# EAGLE design tif (EAGLE 6.5.0)
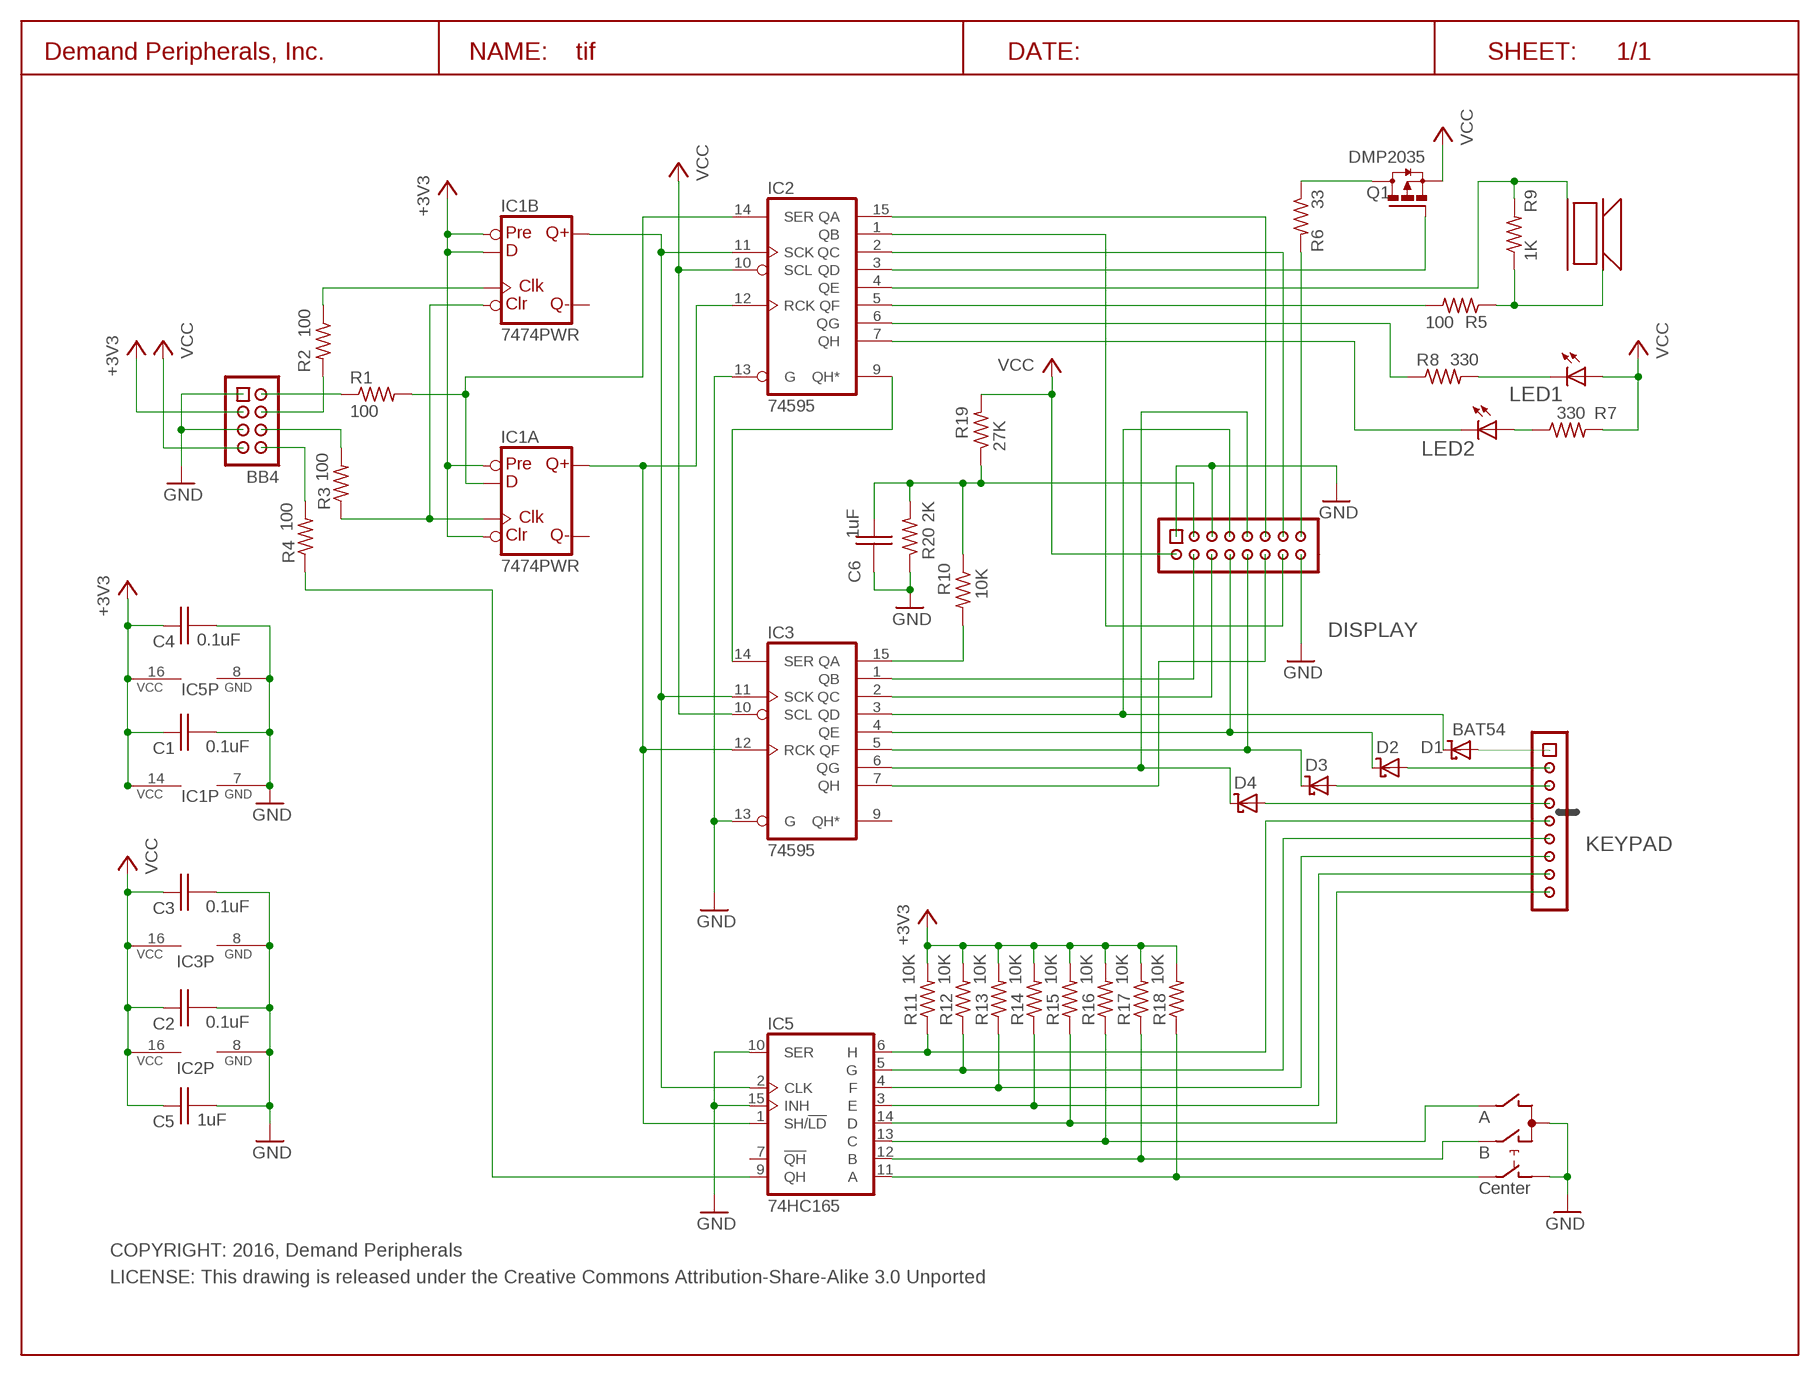
[diagram p0: schematic, sheet 1]

## Parts
2  ROTARY_ENCODER_W_SWITCHCTS_V_290  [CTS_290_VERT]
BB4  Hdr_4x2  HDR-4X2-SHR  [HDR-4X2]
C1  0.1uF  C0.1UF_C0603  [C0603]
C2  0.1uF  C0.1UF_C0603  [C0603]
C3  0.1uF  C0.1UF_C0603  [C0603]
C4  0.1uF  C0.1UF_C0603  [C0603]
C5  1uF  C0.1UF_C0603  [C0603]
C6  1uF  C1.0UF_C0603  [C0603]
D1  BAT54  [SOT23]
D2  BAT54  [SOT23]
D3  BAT54  [SOT23]
D4  BAT54  [SOT23]
DISPLAY  HDR-8X2  [HDR-8X2]
IC1  7474PWR  74AHC74SS  [SO14]
IC2  74595  [SO16]
IC3  74595  [SO16]
IC5  74HC165  [SO16]
KEYPAD  HDR-9X1  [HDR-9X1]
LED1  LED-0805-GRN  [0805]
LED2  LED-0805-RED  [0805]
Q1  DMP2035  [SOT23]
R1  100  R100_R0603  [R0603]
R2  100  R100_R0603  [R0603]
R3  100  R100_R0603  [R0603]
R4  100  R100_R0603  [R0603]
R5  100  R100_R0603  [R0603]
R6  33  R33R0603  [R0603]
R7  330  R330_R0603  [R0603]
R8  330  R330_R0603  [R0603]
R9  1K  R1K_R0603  [R0603]
R10  10K  R10K_R0603  [R0603]
R11  10K  R10K_R0603  [R0603]
R12  10K  R10K_R0603  [R0603]
R13  10K  R10K_R0603  [R0603]
R14  10K  R10K_R0603  [R0603]
R15  10K  R10K_R0603  [R0603]
R16  10K  R10K_R0603  [R0603]
R17  10K  R10K_R0603  [R0603]
R18  10K  R10K_R0603  [R0603]
R19  27K  R27K_R0603  [R0603]
R20  2K  R2K_R0603  [R0603]
SPK1  PKM13EPY  [PKM13EPY]
U$5  DP_FRAME_L  [LETTER_L]

## Nets
+3V3: BB4.3 C1.1 C4.1 IC1.1(A:CLR) IC1.4(A:PRE) IC1.10(B:PRE) IC1.12(B:D) IC1.14(P:VCC) IC5.16(VCC) R11.2 R12.2 R13.2 R14.2 R15.2 R16.2 R17.2 R18.2
GND: 2.C 2.D BB4.1 BB4.5 C1.2 C2.2 C3.2 C4.2 C5.2 C6.2 DISPLAY.1 DISPLAY.5 DISPLAY.16 IC1.7(P:GND) IC2.8(GND) IC2.13(G) IC3.8(GND) IC3.13(G) IC5.8(GND) IC5.10(SER) IC5.15(INH) R20.1
N$1: BB4.2 R1.1
N$2: BB4.8 R4.2
N$3: IC5.9(QH) R4.1
N$4: BB4.6 R3.2
N$5: BB4.4 R2.2
N$6: IC1.2(A:D) IC2.14(SER) R1.2
N$7: IC2.9(QH*) IC3.14(SER)
N$8: C6.1 DISPLAY.3 R10.1 R19.1 R20.2
N$9: 2.E IC5.11(A) R18.1
N$10: D3.3(CC) DISPLAY.10 IC3.5(QF)
N$11: IC3.15(QA) R10.2
N$12: IC1.9(B:Q) IC2.11(SCK) IC3.11(SCK) IC5.2(CLK)
N$15: IC1.3(A:CLK) IC1.13(B:CLR) R3.1
N$17: IC2.7(QH) LED2.C
N$18: IC1.11(B:CLK) R2.1
N$19: IC2.3(QD) Q1.1(G)
N$20: D1.1(A) KEYPAD.1
N$21: D2.1(A) KEYPAD.2
N$22: D3.1(A) KEYPAD.3
N$23: D4.1(A) KEYPAD.4
N$24: D1.3(CC) DISPLAY.7 IC3.3(QD)
N$25: IC2.6(QG) R8.1
N$26: IC2.5(QF) R5.2
N$27: IC2.4(QE) R9.2 SPK1.1(GND1)
N$28: R5.1 R9.1 SPK1.2(GND2)
N$29: Q1.3(D) R6.1
N$30: DISPLAY.11 IC2.15(QA)
N$32: DISPLAY.14 IC2.1(QB)
N$33: DISPLAY.13 IC2.2(QC)
N$34: LED1.C R8.2
N$35: IC1.5(A:Q) IC2.12(RCK) IC3.12(RCK) IC5.1(SH/!LD)
N$36: DISPLAY.4 IC3.1(QB)
N$37: D4.3(CC) DISPLAY.9 IC3.6(QG)
N$38: IC5.6(H) KEYPAD.5 R11.1
N$39: DISPLAY.6 IC3.2(QC)
N$40: IC5.5(G) KEYPAD.6 R12.1
N$42: IC5.4(F) KEYPAD.7 R13.1
N$44: DISPLAY.15 R6.2
N$45: LED2.A R7.1
N$48: DISPLAY.12 IC3.7(QH)
N$50: D2.3(CC) DISPLAY.8 IC3.4(QE)
N$51: IC5.3(E) KEYPAD.8 R14.1
N$52: 2.B IC5.13(C) R16.1
N$53: 2.A IC5.12(B) R17.1
N$54: IC5.14(D) KEYPAD.9 R15.1
VCC: BB4.7 C2.1 C3.1 C5.1 DISPLAY.2 IC2.10(SCL) IC2.16(VCC) IC3.10(SCL) IC3.16(VCC) LED1.A Q1.2(S) R7.2 R19.2
Unconnected: 2.GND1(G) 2.GND2(G) IC1.6(A:!Q) IC1.8(B:!Q) IC3.9(QH*) IC5.7(!QH)

## Notes on the sheet
- A
- B
- Center
- COPYRIGHT: 2016, Demand Peripherals
- LICENSE: This drawing is released under the Creative Commons Attribution-Share-Alike 3.0 Unported

## Library data of the parts
2 = dpi-swsens:ROTARY_ENCODER_W_SWITCH; VENDOR: Digikey; VENDOR-PART-NUM: CT3006-ND
BB4 = dpi-conn:HDR-4X2-SHR: Shrouded 4x2 pin header; VENDOR: Digikey; VENDOR-PART-NUM: 609-3530-ND
C1-C5 = dpi-passive:C0.1UF_: 0.1 uF Capacitor, 25V, X7R; VENDOR: Digikey; VENDOR-PART-NUM: 1276-1126-2-ND
C6 = dpi-passive:C1.0UF_: 1.0 uF Capacitor, 25V, Y5V; VENDOR: Digikey; VENDOR-PART-NUM: 490-3897-2-ND
D1-D4 = dpi-diopto:BAT54: Schottky Diode; VENDOR: Digikey; VENDOR-PART-NUM: DB3Y313KELCT-ND
DISPLAY = dpi-conn:HDR-8X2: Header, 8x2, 0.1 inch; VENDOR: Digikey; VENDOR-PART-NUM: S2012EC-08-ND
IC1 = dpi-transic:74AHC74: Dual D type positive edge triggered FLIP FLOP, preset and clear; VENDOR: Digikey; VENDOR-PART-NUM: 568-4458-1-ND
IC2 IC3 = dpi-transic:74*595: 8-bit SHIFT REGISTER, output latch; VENDOR: Digikey; VENDOR-PART-NUM: 74HC595D(BJ)CT-ND
IC5 = dpi-transic:74HC165: NXP 74HC165 parallel-to-serial shift register; VENDOR: Digikey; VENDOR-PART-NUM: 568-1409-1-ND
KEYPAD = dpi-conn:HDR-9X1: Header, 9x1; VENDOR: Digikey; VENDOR-PART-NUM: S1012EC-09-ND
LED1 = dpi-diopto:LED-0805-GRN: Green 0805 LED, 26mcd@20ma, 160degree; VENDOR: Digikey; VENDOR-PART-NUM: 475-1410-1-ND
LED2 = dpi-diopto:LED-0805-RED: Red 0805 LED, 41mcd@20ma, 160degree; VENDOR: Digikey; VENDOR-PART-NUM: 475-1415-6-ND
Q1 = dpi-transic:DMP2035: PFET; VENDOR: Digikey; VENDOR-PART-NUM: DMP2035U-7DICT-ND
R1-R5 = dpi-passive:R100_: 100 Ohm resistor, 1%, 0.1 watt; VENDOR: Digikey; VENDOR-PART-NUM: 311-100HRTR-ND
R6 = dpi-passive:R33: 33 Ohm resistor, 1%, 0.1 watt; VENDOR: Digikey; VENDOR-PART-NUM: 311-33.0HRTR-ND
R7 R8 = dpi-passive:R330_: 330 Ohm resistor, 1%, 0.1 watt; VENDOR: Digikey; VENDOR-PART-NUM: 311-330HRTR-ND
R9 = dpi-passive:R1K_: 1K Resistor, 1%, 0.1 watt; VENDOR: Digikey; VENDOR-PART-NUM: 311-1.00KHRTR-ND
R10-R18 = dpi-passive:R10K_: 10K Resistor, 1%, 0.1 watt; VENDOR: Digikey; VENDOR-PART-NUM: 311-1.00KHRTR-ND
R19 = dpi-passive:R27K_: 27K Resistor, 1%, 0.1 watt; VENDOR: Digikey; VENDOR-PART-NUM: 311-27.0KHRTR-ND
R20 = dpi-passive:R2K_: 2K Resistor, 1%, 0.1 watt; VENDOR: Digikey; VENDOR-PART-NUM: 311-2.00KHRTR-ND
SPK1 = dpi-swsens:PKM13EPY: Murata PKM13EPY piezo speaker; VENDOR: Sparkfun; VENDOR-PART-NUM: 490-4698-ND
U$5 = DP:DP_FRAME_L: Landscape/Letter Document Frame

## Board
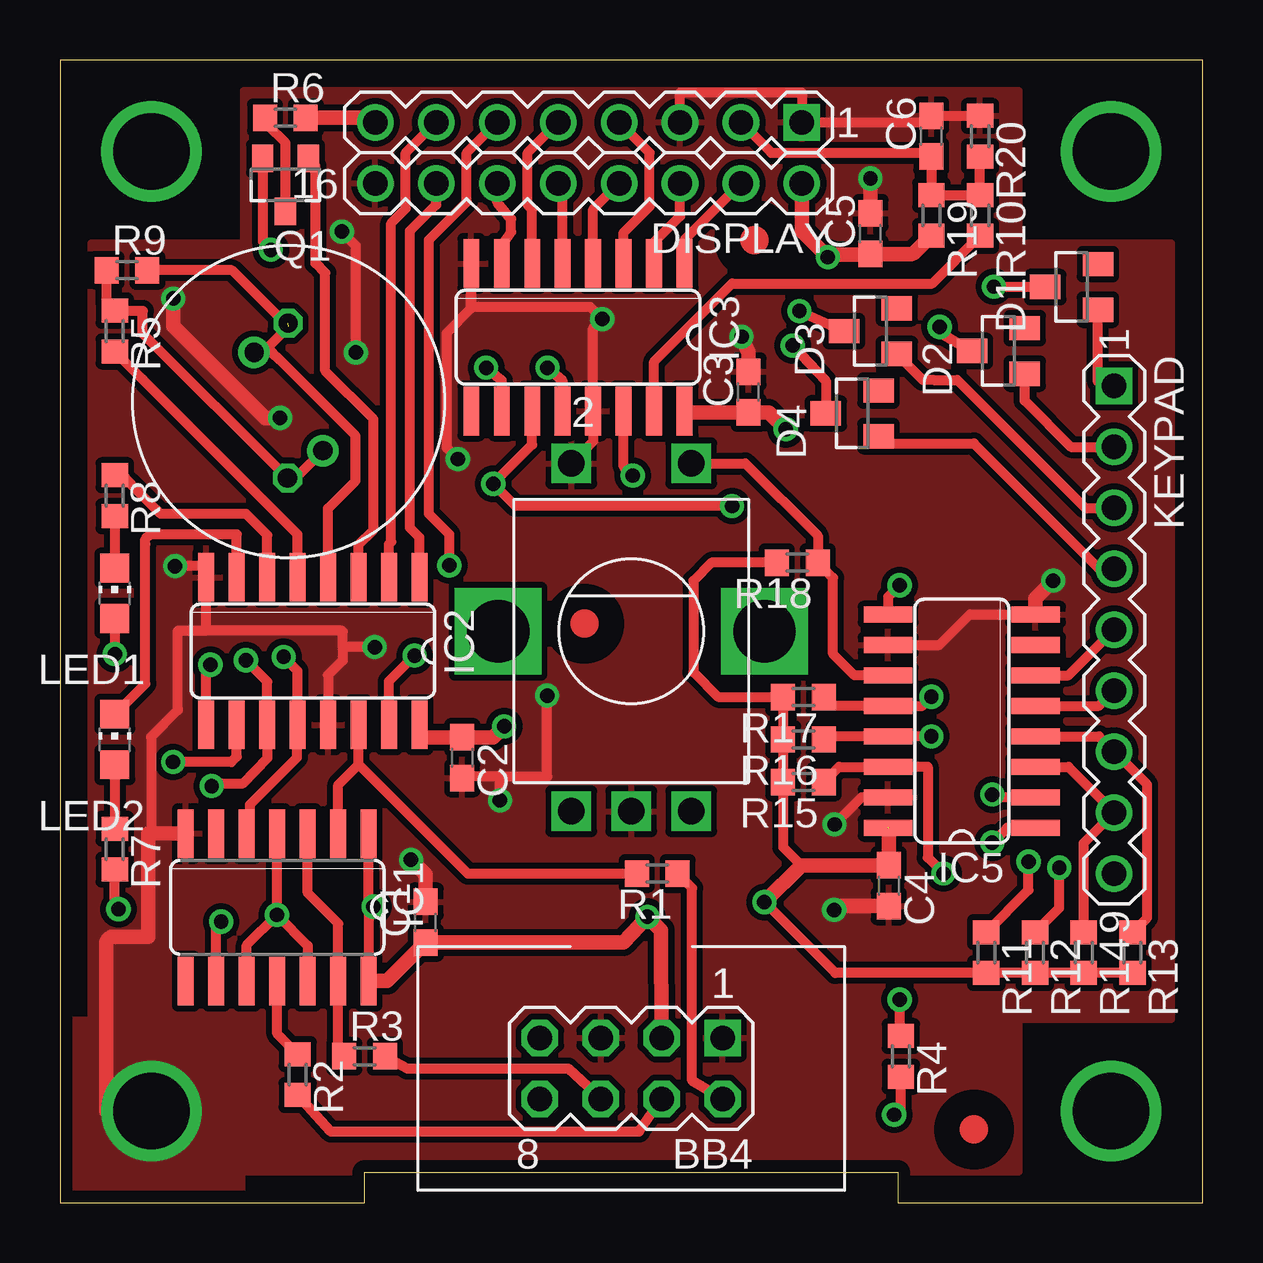
[diagram p1: board, top side]
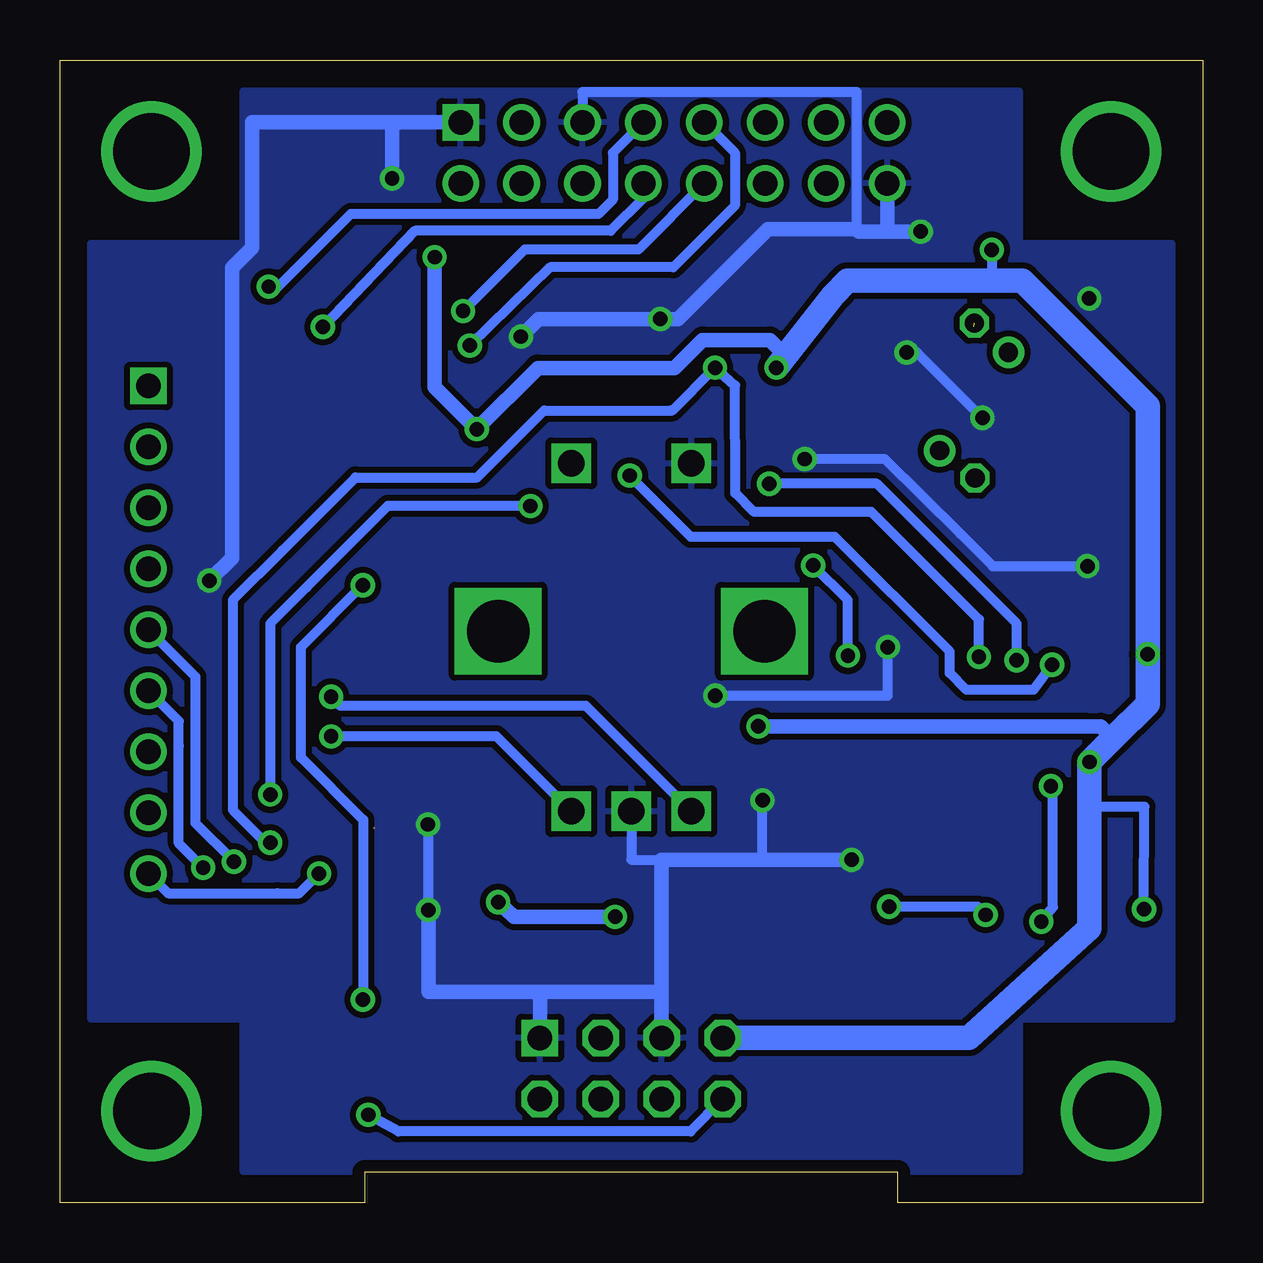
[diagram p2: board, bottom side, seen from below]

Size 47.62 x 47.62 mm. Coordinates in mm from the lower left corner, seen from the top.
Outline: 0,0 12.7,0 12.7,1.27 34.92,1.27 34.92,0 47.62,0 47.62,47.62 0,47.62 0,0
Copper layers (1*16): Top 0.035mm / dielectric 1.5mm / Bottom 0.035mm
Design rules "default *": minimum track width 10mil, minimum drill 20mil, track to track 10mil, track to pad 10mil, pad to pad 10mil, via to via 10mil, smd to smd 10mil, copper to edge 20mil, drill to drill 12mil, minimum pad ring 10mil, minimum via ring 8mil, stop-mask expansion 4mil, vias tented up to drill 0mil, thermal gap 10mil
tKeepout: area 15.1,1.3 to 32.5,9.9

### Footprints (pad centres in the part's own frame; a part is rotated, then mirrored left to right if it is on the bottom)
CTS_290_VERT = drill 1.1 square: A -2.5,-7.5; B 2.5,-7.5; C 0,-7.5; D -2.5,7; E 2.5,7 | drill 2.6 square: GND1 -5.55,0; GND2 5.55,0
HDR-4X2 = drill 1.016 square: 1 -3.81,-1.27 | drill 1.016 octagon: 2 -3.81,1.27; 3 -1.27,-1.27; 4 -1.27,1.27; 5 1.27,-1.27; 6 1.27,1.27; 7 3.81,-1.27; 8 3.81,1.27
C0603 = smd 1.1 x 1: 1 -0.85,0; 2 0.85,0
SOT23 = smd 1.016 x 1.27: 1 -0.95,-1.1; 2 0.95,-1.1; 3 0,1.1
HDR-8X2 = drill 1.016 square: 1 -8.89,-1.27 | drill 1.016: 2 -8.89,1.27; 3 -6.35,-1.27; 4 -6.35,1.27; 5 -3.81,-1.27; 6 -3.81,1.27; 7 -1.27,-1.27; 8 -1.27,1.27; 9 1.27,-1.27; 10 1.27,1.27; 11 3.81,-1.27; 12 3.81,1.27; 13 6.35,-1.27; 14 6.35,1.27; 15 8.89,-1.27; 16 8.89,1.27
SO14 = smd 0.66 x 2.032: 1 -3.81,-3.073; 2 -2.54,-3.073; 3 -1.27,-3.073; 4 0,-3.073; 5 1.27,-3.073; 6 2.54,-3.073; 7 3.81,-3.073; 8 3.81,3.073; 9 2.54,3.073; 10 1.27,3.073; 11 0,3.073; 12 -1.27,3.073; 13 -2.54,3.073; 14 -3.81,3.073
SO16 = smd 0.66 x 2.032: 1 -4.445,-3.073; 2 -3.175,-3.073; 3 -1.905,-3.073; 4 -0.635,-3.073; 5 0.635,-3.073; 6 1.905,-3.073; 7 3.175,-3.073; 8 4.445,-3.073; 9 4.445,3.073; 10 3.175,3.073; 11 1.905,3.073; 12 0.635,3.073; 13 -0.635,3.073; 14 -1.905,3.073; 15 -3.175,3.073; 16 -4.445,3.073
HDR-9X1 = drill 1.016 square: 1 0,-10.16 | drill 1.016: 2 0,-7.62; 3 0,-5.08; 4 0,-2.54; 5 0,0; 6 0,2.54; 7 0,5.08; 8 0,7.62; 9 0,10.16
0805 = smd 1.2 x 1.2: A -1.05,0; C 1.05,0
SOT23' = smd 0.889 x 1.143: 1 -0.95,-1.1; 2 0.95,-1.1; 3 0,1.1
R0603 = smd 1 x 1.1: 1 -0.85,0; 2 0.85,0
PKM13EPY = drill 0.8: 1 -2.5,0; 2 2.5,0

### Placement (x,y rotation side)
2  23.81,23.81 0 top
BB4  23.81,5.59 180 top
C1  15.24,11.68 90 top
C2  16.76,18.54 270 top
C3  28.7,33.78 90 top
C4  34.54,13.21 270 top
C5  33.78,40.39 90 top
C6  36.32,44.45 90 top
D1  42.16,38.16 90 top
D2  39.12,35.5 90 top
D3  33.78,36.32 90 top
D4  33.02,32.89 90 top
DISPLAY  22.03,43.75 180 top
IC1  9.06,12.31 180 top
IC2  10.54,22.99 180 top
IC3  21.59,36.07 180 top
IC5  37.59,20.07 90 top
KEYPAD  43.94,23.88 180 top
LED1  2.29,25.4 90 top
LED2  2.29,19.3 90 top
Q1  DMP2035  [SOT23']  9.4,42.42 180 top
R1  24.89,13.72 180 top
R2  9.91,5.33 270 top
R3  12.7,6.1 0 top
R4  35.05,6.1 270 top
R5  2.29,36.32 270 top
R6  9.4,45.21 0 top
R7  2.29,14.73 270 top
R8  2.29,29.46 270 top
R9  2.79,38.86 0 top
R10  38.35,41.15 270 top
R11  38.61,10.41 270 top
R12  40.64,10.41 270 top
R13  44.7,10.41 270 top
R14  42.67,10.41 270 top
R15  30.99,17.53 180 top
R16  30.99,19.3 180 top
R17  30.99,21.07 180 top
R18  30.73,26.67 180 top
R19  36.32,41.15 270 top
R20  38.35,44.45 270 top
SPK1  9.53,33.39 305 top
U$1  [DPI-2]  18.8,12.45 0 bottom
U$2  [FIDUCIAL]  38.1,3.05 0 top
U$3  [FIDUCIAL]  28.94,40.12 0 top
U$4  [FIDUCIAL]  21.86,24.13 0 top
U$5  -1.99,-2.22 90 top

### Tracks (layer width: path | path; a pad name or v marks a point on that pad's centre or on a via)
+3V3  (via drill 0.6)  (1 unrouted)
  Top 0.406: IC1.4 9.04,15.37 v9.04,11.99 | IC1.12 10.32,10.71 v9.04,11.99 | IC1.10 7.79,10.73 v9.04,11.99 | IC1.1 12.87,12.33 v13.07,12.33 12.87,12.13 IC1.14 | R13.2 R14.2 R12.2 R11.2 32.32,9.56 v29.36,12.52 | R18.2 27.16,26.67 26.4,25.91 26.4,22.11 27.43,21.08 30.12,21.08 R17.2 R16.2 R15.2 30.14,14.82 30.9,14.06
  Top 0.61: 34.54,15.62 C4.1 30.9,14.06 v29.36,12.52 | IC1.14 13.64,9.23 C1.1 23.48,10.83 v24.49,11.91 25.06,11.35 BB4.3
  Bottom 0.406: v13.07,12.33 9.38,12.33 v9.04,11.99
  Bottom 0.61: v29.36,12.52 28.69,11.91 v24.49,11.91
GND  (via drill 0.6, 3.17 pad 3.17)
  Top 0.406: R20.1 C6.2 36.04,45.02 DISPLAY.1 30.92,46.28 25.84,46.28 DISPLAY.5 | 2.D 22.23,31.73 IC3.13 22.23,36.45 v22.61,36.83 22.1,37.34 20.57,37.34 17.14,37.34 IC3.8 17.14,37.27 16.13,36.26 16.13,31.45 v16.59,30.99 | C2.2 16.7,17.75 18.34,17.75 | 6.1,23.84 IC2.8 6.1,26.53 v4.8,26.53 | v20.31,21.13 20.31,17.75 18.34,17.75 | 6.1,23.84 11.75,23.84 11.79,23.8 11.79,23.16 | IC2.13 11.18,21.98 11.79,22.59 11.79,23.16 | v12.33,35.43 12.33,39.89 v11.75,40.48 | v13.12,23.15 13.12,23.16 11.79,23.16 | v18.34,16.76 18.34,17.75 | IC1.7 3.91,15.38 | 3.91,15.38 3.58,15.38 | 6.1,23.84 4.93,23.84 4.92,23.82 4.92,20.59 4.92,20.52 3.8,19.41 3.8,15.49 3.91,15.38 | IC5.10 36.66,23.24 37.94,24.51 IC5.8 | IC5.15 33.41,16.89 v32.28,15.76
  Top 0.61: v33.78,42.69 C5.2 | C3.2 28.69,35.42 v28.41,36.09 | v3.81,3.81 1.93,3.81 1.93,10.78 arc-90 2.22,11.07 3.68,11.07 3.68,15.38 3.91,15.38 IC1.7 | C1.2 15.24,13.68 v14.63,14.29 | v4.72,37.68 4.72,36.54 8.2,33.06 8.55,32.71 v9.17,32.71 | IC5.8 40.66,25.18 v41.4,25.92 | C4.2 32.44,12.36 v32.27,12.19
  Bottom 0.406: DISPLAY.5 25.84,46.29 14.41,46.29 14.41,40.56 14.33,40.48 | v16.59,30.99 13.23,30.99 10.1,27.88 8.75,26.53 v4.8,26.53 | v13.12,23.15 13.12,21.13 v20.31,21.13 | v18.34,16.76 18.34,14.29 18.3,14.29 | v12.33,35.43 11.9,35.43 v9.17,32.71 | 2.C 23.81,14.29 22.54,14.29 | v32.28,15.76 32.28,12.21 v32.27,12.19
  Bottom 0.61: v33.78,42.69 33.78,44.7 arc90 33.47,45.02 | DISPLAY.1 33.47,45.02 | 33.47,45.02 39.62,45.02 39.62,39.8 40.45,38.98 40.45,27 40.45,26.87 v41.4,25.92 | 14.91,14.29 v14.63,14.29 18.3,14.29 22.54,14.29 22.54,8.78 | 22.54,8.78 BB4.5 | 27.62,8.78 BB4.1 | 22.54,8.78 27.62,8.78 | 14.33,40.48 13.14,40.48 | 13.14,40.48 DISPLAY.16 | 13.14,40.48 v11.75,40.48 | 14.41,40.56 18.12,40.56 21.87,36.82 22.59,36.82 v22.61,36.83 27.67,36.83 v28.41,36.09 | v32.27,12.19 32.27,8.78 27.62,8.78
  pour Bottom (isolate 0.254): 40.01,1.27 40.01,7.62 46.35,7.62 46.35,40.01 40.01,40.01 40.01,46.35 7.62,46.35 7.62,40.01 1.27,40.01 1.27,7.62 7.62,7.62 7.62,1.27
  pour Top (isolate 0.254): 40.01,1.27 40.01,7.62 46.35,7.62 46.35,40.01 40.01,40.01 40.01,46.35 7.62,46.35 7.62,40.01 1.27,40.01 1.27,7.62 0.51,7.62 0.51,0.51 7.62,0.51 7.62,1.27
MOUNT  (via drill 3.17 pad 3.17)
  other vias: 43.81,43.81
N$1
  Top 0.406: BB4.2 26.35,5.08 26.35,13.11 R1.1
N$2  (via drill 0.6)
  Top 0.406: R4.2 35.05,3.94 v34.77,3.66
  Bottom 0.406: v34.77,3.66 33.52,2.96 21.34,2.96 BB4.8
N$3  (via drill 0.6)
  Top 0.406: v35,25.73 34.52,25.25 IC5.9 | R4.1 35,6.95 v35,8.46
  Bottom 0.406: v35,25.73 37.58,23.15 37.58,18.54 34.99,15.95 34.99,8.47 v35,8.46
N$4
  Top 0.406: BB4.6 21.18,5.59 14.48,5.59 R3.2
N$5
  Top 0.406: BB4.4 24.14,2.96 11.29,2.96 R2.2
N$6
  Top 0.406: 12.45,18.26 IC2.14 | IC1.2 11.6,17.41 12.45,18.26 | 12.45,18.26 16.99,13.72 R1.2
N$7  (via drill 0.6)
  Top 0.406: v23.88,30.3 23.5,30.68 IC3.14 | IC2.9 6.1,22.05 v6.27,22.42
  Bottom 0.406: v6.27,22.42 7.05,21.37 9.84,21.37 10.54,22.07 10.54,22.96 15.33,27.75 21.32,27.75 v23.88,30.3
N$8
  Top 0.406: R20.2 R10.1 R19.1 C6.1 36.17,43.75 29.65,43.75 DISPLAY.3
N$9
  Top 0.406: R18.1 31.5,26.58 | IC5.11 33.12,21.97 32.22,22.87 32.22,26.03 R18.1 | 2.E 28.57,30.81 31.59,27.8 R18.1
N$10  (via drill 0.6)
  Top 0.406: v30.82,37.16 D3.3 | IC3.5 20.95,42.29 DISPLAY.10
  Bottom 0.406: DISPLAY.10 23.52,39.73 28.26,39.73 v30.82,37.16
N$11
  Top 0.406: IC3.15 24.77,35.05 28.02,38.3 36.36,38.3 R10.2
N$12  (via drill 0.6)
  Top 0.406: v6.72,11.71 6.51,11.54 IC1.9 | v6.33,17.36 6.62,17.48 7.63,17.48 8.65,18.53 IC2.11 8.64,21.72 v7.75,22.61 | IC3.11 19.68,31.59 v18.06,29.96 18.99,29.03 v28.02,29.03 | IC5.2 38.98,16.89 v38.86,17
  Bottom 0.406: v6.72,11.71 6.24,12.31 6.24,17.27 v6.33,17.36 | v18.06,29.96 13.58,29.96 7.75,24.13 v7.75,22.61 | v28.02,29.03 33.96,29.03 37.34,25.65 38.86,24.13 v38.86,17
N$15
  Top 0.406: R3.1 11.6,6.35 IC1.13 11.6,11.63 10.32,12.9 IC1.3
N$17
  Top 0.406: IC2.7 7.37,27.85 3.75,27.85 3.56,27.66 3.56,27.43 3.56,21.62 LED2.C
N$18
  Top 0.406: R2.1 9.05,7.04 IC1.11
N$19
  Top 0.406: Q1.1 10.65,43.21 10.65,41.74 10.65,39.15 11.06,38.75 11.06,34.66 13.07,32.65 13.07,28.04 12.45,27.42 IC2.3
N$20
  Top 0.406: KEYPAD.1 43.26,34.21 D1.1
N$21
  Top 0.406: KEYPAD.2 42.14,31.5 40.22,33.42 D2.1
N$22
  Top 0.406: KEYPAD.3 42.74,28.96 37.4,34.29 36.4,34.29 35.96,34.29 D3.1
N$23
  Top 0.406: KEYPAD.4 43.32,26.42 38.1,31.64 34.68,31.64 34.43,31.64 D4.1
N$24  (via drill 0.6)
  Top 0.406: DISPLAY.7 24.57,43.75 24.57,41.52 23.5,40.44 IC3.3 | D1.3 41.05,38.18 v38.92,38.18
  Bottom 0.406: DISPLAY.7 24.57,43.75 24.57,41.81 25.18,41.2 35.51,41.2 38.53,38.18 v38.92,38.18
N$25
  Top 0.406: IC2.6 8.64,27.81 7.75,28.7 4.2,28.7 2.95,29.95 2.59,30.31 R8.1
N$26
  Top 0.406: R5.2 3.4,34.35 | 3.4,34.35 3.46,34.3 | IC2.5 9.91,27.84 7.8,29.95 3.4,34.35
N$27  (via drill 0.8)  (1 unrouted)
  Top 0.406: R9.2 7.17,38.86 9.53,36.51 8.45,35.44 SPK1.1 8.85,35.44 9.17,35.12 12.32,31.97 12.32,30.07 11.18,28.93 IC2.4
  other vias: 9.51,36.65
N$28  (via drill 0.8)
  Top 0.406: R9.1 1.94,37.51 R5.1 | R5.1 2.62,37.17 | R5.1 3.46,37.17 3.46,36.22 v9.48,30.2 9.81,30.2 SPK1.2
N$29
  Top 0.406: Q1.3 9.4,44.17 8.69,44.88 8.69,45.07 R6.1
N$30  (via drill 0.6)
  Top 0.406: DISPLAY.11 16.95,43.75 16.95,41.71 15.38,40.13 15.38,36.8 15.38,28.7 16.23,27.85 v16.23,26.56 | IC2.15 13.72,21.73 v14.78,22.8
  Bottom 0.406: v14.78,22.8 14.78,25.11 v16.23,26.56
N$32
  Top 0.406: DISPLAY.14 15.68,41.74 15.68,41.59 14.59,40.5 14.59,28.12 14.68,28.03 14.99,27.72 14.99,27.38 IC2.1
N$33
  Top 0.406: DISPLAY.13 14.41,43.75 14.41,41.72 14.41,41.43 13.8,40.82 13.8,27.53 13.72,27.45 IC2.2
N$34
  Top 0.406: R8.2 LED1.C
N$35  (via drill 0.6)
  Top 0.406: IC3.12 20.94,34.27 v20.32,34.8 | IC1.5 arc90 7.92,15.52 7.92,16.59 9.88,18.54 9.88,20.36 IC2.12 9.91,22.16 v9.32,22.75 | IC5.1 39.48,15.62 v38.86,15
  Bottom 0.406: v9.32,22.75 9.32,24.31 13.8,28.79 18.69,28.79 19.47,29.57 19.48,34.06 v20.32,34.8 22.1,33.02 22.17,33.02 27.45,33.02 30.24,30.23 35.31,30.23 38.35,27.18 40.42,25.11 40.42,16.37 39.05,15 v38.86,15
N$36
  Top 0.406: DISPLAY.4 26.04,40.13 IC3.1
N$37  (via drill 0.6)
  Top 0.406: DISPLAY.9 19.49,43.75 19.49,41.58 19.68,41.39 IC3.6 | v30.54,35.73 31.92,34.26 D4.3
  Bottom 0.406: DISPLAY.9 19.49,43.75 19.49,41.56 22.06,38.99 27.19,38.99 v30.54,35.73
N$38  (via drill 0.6)
  Top 0.406: IC5.6 42.04,21.97 KEYPAD.5 | R11.1 40.37,13.03 v40.37,14.21
  Bottom 0.406: v40.37,14.21 41.97,15.81 41.97,21.35 41.97,21.91 KEYPAD.5
N$39
  Top 0.406: DISPLAY.6 25.84,41.11 24.77,40.03 IC3.2
N$40  (via drill 0.6)
  Top 0.406: IC5.5 43.31,20.7 KEYPAD.6 | R12.1 41.66,12.28 v41.66,13.96
  Bottom 0.406: v41.66,13.96 42.67,14.97 42.67,19.04 42.67,20.07 KEYPAD.6
N$41  (via drill 3.17 pad 3.17)
  other vias: 3.81,43.81
N$42
  Top 0.406: IC5.4 43.31,19.43 KEYPAD.7 45.31,17.42 45.31,14.92 45.31,11.87 R13.1
N$43  (via drill 3.17 pad 3.17)
  other vias: 43.81,3.81
N$44
  Top 0.61: DISPLAY.15 13.14,45.21 R6.2
N$45
  Top 0.406: LED2.A R7.1
N$48
  Top 0.406: IC3.7 18.53,38.67 18.53,40.04 18.81,40.45 18.81,41 18.22,41.71 DISPLAY.12
N$50  (via drill 0.6)
  Top 0.406: D2.3 37.99,35.5 36.66,36.27 v36.66,36.5 | IC3.4 22.23,41.4 DISPLAY.8
  Bottom 0.406: DISPLAY.8 23.3,41.87 24.68,40.5 32.83,40.5 v36.66,36.5
N$51
  Top 0.406: IC5.3 42.04,18.16 KEYPAD.8 42.67,14.99 R14.1
N$52  (via drill 0.6)
  Top 0.406: R16.1 31.96,19.43 IC5.13 v36.32,19.43
  Bottom 0.406: 2.B 29.43,19.43 v36.32,19.43
N$53  (via drill 0.6)
  Top 0.406: R17.1 32.21,20.7 IC5.12 35.94,20.7 v36.32,21.08
  Bottom 0.406: 2.A 25.7,20.7 35.94,20.7 v36.32,21.08
N$54  (via drill 0.6)
  Top 0.406: R15.1 32.47,18.16 IC5.14 36.17,18.16 36.17,14.38 v36.83,13.72
  Bottom 0.406: KEYPAD.9 43.12,12.89 38.56,12.89 37.66,12.89 v36.83,13.72
VCC  (via drill 0.6)
  Top 0.406: 18.41,33.31 IC3.10 18.41,34.28 v17.77,34.8 | R7.2 2.29,12.55 v2.44,12.23 | IC2.10 7.37,18.59 7.14,18.36 v4.71,18.36 | LED1.A v2.29,22.86 | Q1.2 8.45,40.05 v8.79,39.71
  Top 0.61: R19.2 35.65,39.63 arc-45 35.43,39.54 C5.1 33.76,39.51 32.11,39.51 v32,39.41 30.92,40.49 DISPLAY.2 | IC3.16 26.04,32.93 C3.1 29.55,32.93 v30.25,32.23 | C2.1 16.69,19.47 | IC2.16 14.99,19.39 C2.1 | C2.1 18.06,19.39 v18.52,19.85
  Bottom 0.406: v2.44,12.23 2.43,16.5 4.71,16.5 | v8.79,39.71 8.79,38.42
  Bottom 0.61: v32,39.41 32,33.98 v30.25,32.23 27.7,34.78 22.01,34.78 20.84,35.95 18.03,35.95 17.66,35.58 17.15,35.58 | v18.52,19.85 4.88,19.85 4.24,19.85 3.73,19.34
  Bottom 1.016: BB4.7 9.74,6.86 4.71,11.43 4.71,16.5 4.71,17.13 v4.71,18.36 3.73,19.34 2.29,20.79 v2.29,22.86 2.29,33.2 7.51,38.42 8.79,38.42 14.8,38.42 15.4,37.81 17.15,35.58 v17.77,34.8

### Text on the board
tTest: 1.875 Inches | 1.575 Inches | Display | R6 | C6 | Q1 | R20 | R9 | C5 | R10 | D3 | D1 | IC3 | R19 | D2 | R5 | Piezo | D4 | C3 | R8 | Rotary | R18 | 1 | Keypad | 2 | IC2 | R17 | R16 | C2 | R15 | IC1 | R7 | 1.575 Inches | 1.875 Inches | R1 | IC4 | C1 | C4 | TIF, Rev 18A | BB4 | R11 | R12 | R14 | R13 | R3 | R4 | R2
bTest: (C) 2017, Demand Peripherals